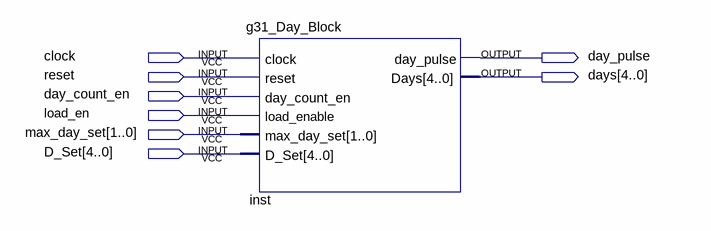
[diagram p0: schematic sheet]
// Quartus schematic g31_day_counter.bdf as structural Verilog: 1 symbols, 8 pins
module g31_day_counter (
  input  clock,
  input  reset,
  input  day_count_en,
  input  load_en,
  input  [1:0] max_day_set,
  input  [4:0] D_Set,
  output day_pulse,
  output [4:0] days
);

  g31_Day_Block inst (
    .clock(clock), .reset(reset), .day_count_en(day_count_en), .load_enable(load_en),
    .max_day_set(max_day_set), .D_Set(D_Set), .day_pulse(day_pulse), .Days(days));
endmodule
